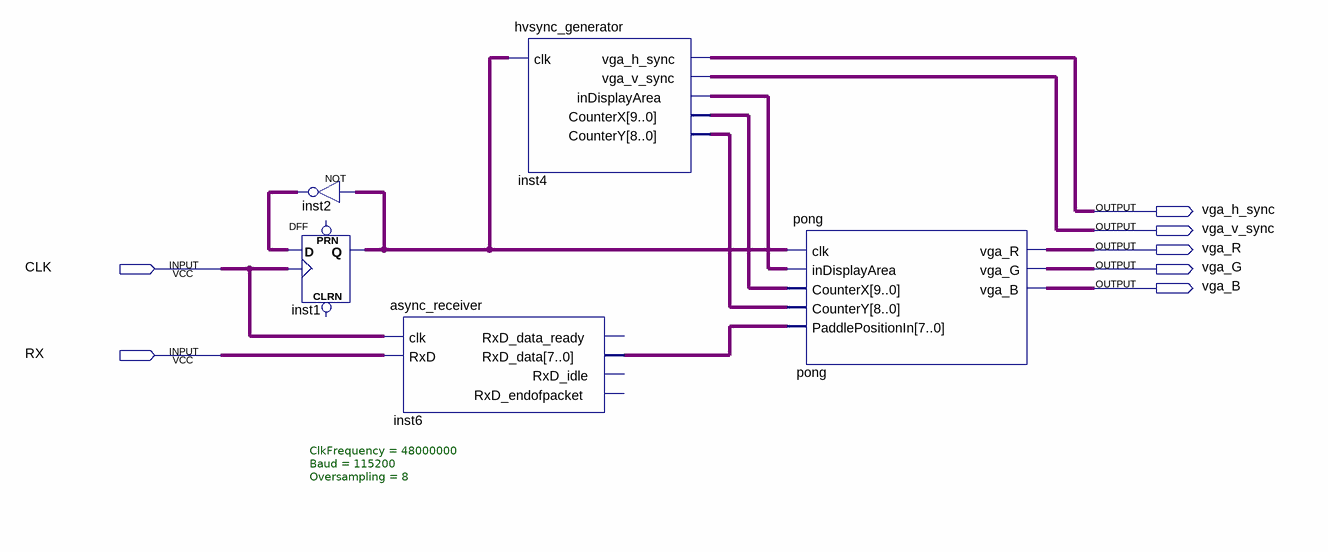
[diagram p0: schematic sheet]
// Quartus schematic VGA.bdf as structural Verilog: 5 symbols, 7 pins
module VGA (
  input  CLK,
  input  RX,
  output vga_h_sync,
  output vga_v_sync,
  output vga_R,
  output vga_G,
  output vga_B
);

  wire inst1_q, inst2_out, inst4_indisplayarea;
  wire [7:0] inst6_rxd_data;
  wire [8:0] inst4_countery;
  wire [9:0] inst4_counterx;

  not inst2 (inst2_out, inst1_q);
  DFF inst1 (.CLK(CLK), .D(inst2_out), .Q(inst1_q));  // open: CLRN, PRN
  async_receiver #(.ClkFrequency(48000000), .Baud(115200), .Oversampling(8)) inst6 (
    .clk(CLK), .RxD(RX), .RxD_data(inst6_rxd_data));  // open: RxD_data_ready, RxD_idle, RxD_endofpacket
  hvsync_generator inst4 (
    .clk(inst1_q), .vga_h_sync(vga_h_sync), .vga_v_sync(vga_v_sync), .inDisplayArea(inst4_indisplayarea),
    .CounterX(inst4_counterx), .CounterY(inst4_countery));
  pong pong (
    .clk(inst1_q), .inDisplayArea(inst4_indisplayarea), .CounterX(inst4_counterx), .CounterY(inst4_countery),
    .PaddlePositionIn(inst6_rxd_data), .vga_R(vga_R), .vga_G(vga_G), .vga_B(vga_B));
endmodule
